# Altium schematic sheet LIDO-HW.100.Page_10.SchDoc
size A3; SheetNumber: 14; SheetTotal: 14
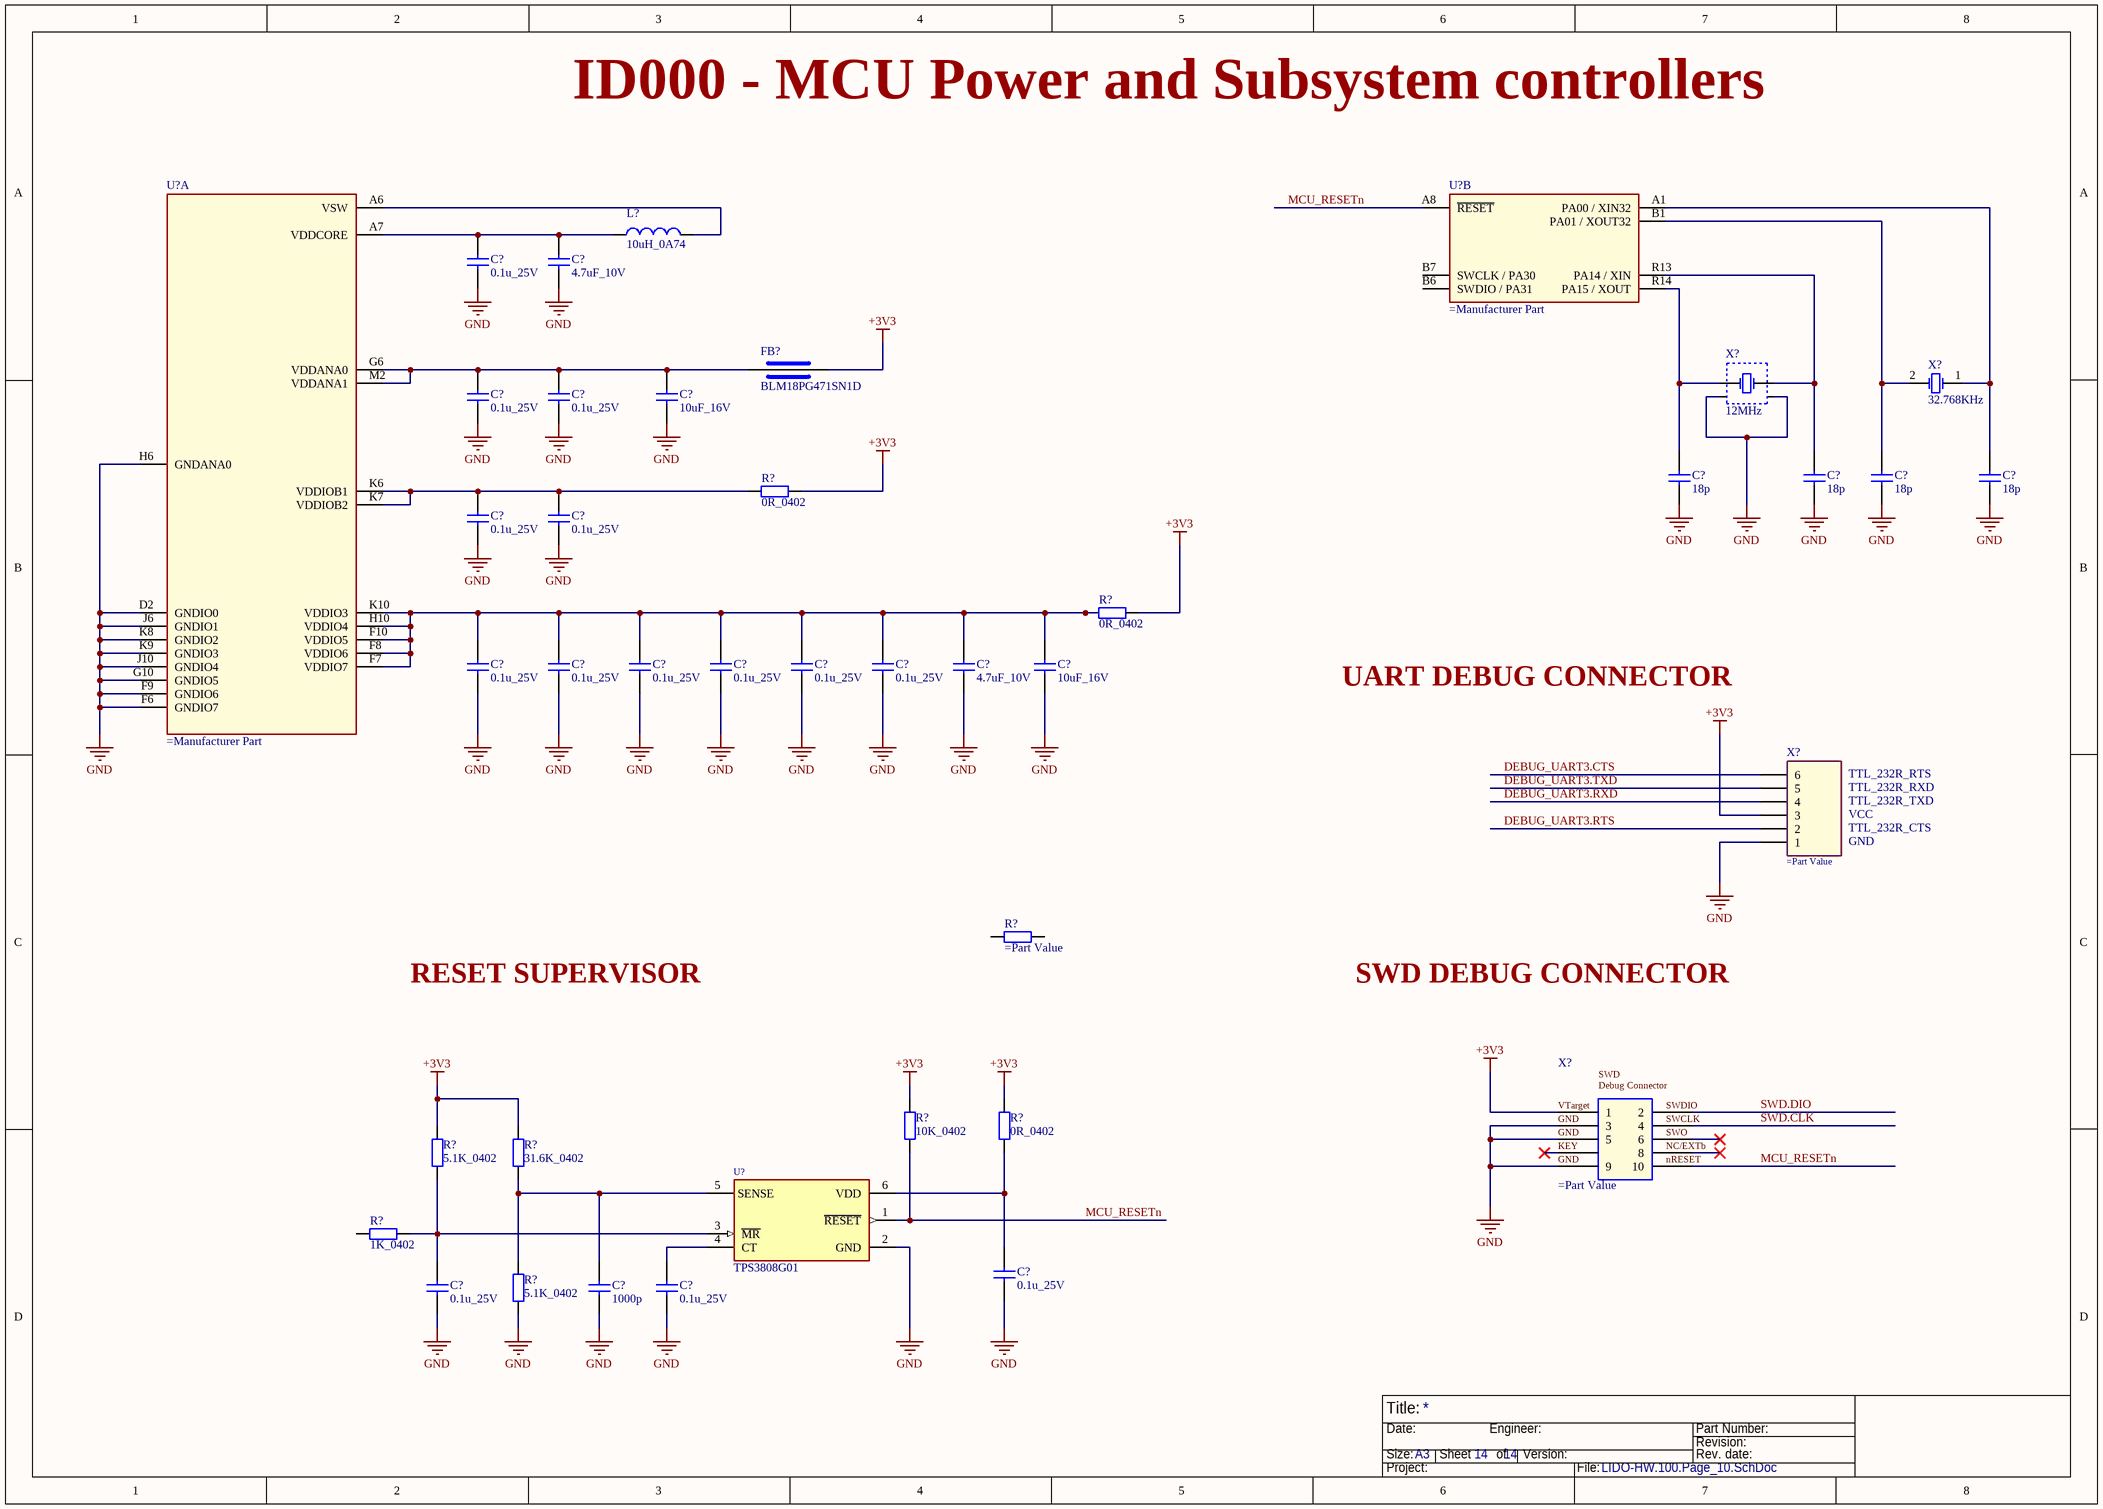
[diagram p0: LIDO-HW.100.Page_10.SchDoc]

## Parts
(Parts that share a designator on the sheet are numbered #1, #2 ... from top to bottom, then left to right.)
C?#1  0.1u_25V
C?#2  4.7uF_10V
C?#3  0.1u_25V
C?#4  0.1u_25V
C?#5  10uF_16V
C?#6  18p
C?#7  18p
C?#8  18p
C?#9  18p
C?#10  0.1u_25V
C?#11  0.1u_25V
C?#12  0.1u_25V
C?#13  0.1u_25V
C?#14  0.1u_25V
C?#15  0.1u_25V
C?#16  0.1u_25V
C?#17  0.1u_25V
C?#18  4.7uF_10V
C?#19  10uF_16V
C?#20  0.1u_25V
C?#21  0.1u_25V
C?#22  1000p
C?#23  0.1u_25V
FB?  BLM18PG471SN1D
L?  10uH_0A74
R?#1  0R_0402
R?#2  0R_0402
R?#3  (no value)
R?#4  10K_0402
R?#5  0R_0402
R?#6  5.1K_0402
R?#7  31.6K_0402
R?#8  1K_0402
R?#9  5.1K_0402
U?#1  (no value)  (part B of 4)
U?#2  (no value)  (part A of 4)
U?#3  TPS3808G01  [SOT95P280X145-6N]
X?#1  12MHz
X?#2  32.768KHz
X?#3  (no value)
X?#4  (no value)

## Nets
+3V3: FB?.2 R?#1.2 R?#2.2 R?#4.2 R?#5.2 R?#6.2 R?#7.2 X?#3.3 X?#4.1
GND: C?#1.2 C?#2.2 C?#3.2 C?#4.2 C?#5.2 C?#6.2 C?#7.2 C?#8.2 C?#9.2 C?#10.2 C?#11.2 C?#12.2 C?#13.2 C?#14.2 C?#15.2 C?#16.2 C?#17.2 C?#18.2 C?#19.2 C?#20.2 C?#21.2 C?#22.2 C?#23.2 R?#9.1 U?#2.D2(GNDIO0) U?#2.F6(GNDIO7) U?#2.F9(GNDIO6) U?#2.G10(GNDIO5) U?#2.H6(GNDANA0) U?#2.J6(GNDIO1) U?#2.J10(GNDIO4) U?#2.K8(GNDIO2) U?#2.K9(GNDIO3) U?#3.2(GND) X?#1.2(GND) X?#1.4(GND) X?#3.1 X?#4.3 X?#4.5 X?#4.9
DEBUG_UART3.CTS: X?#3.6
DEBUG_UART3.RTS: X?#3.2
DEBUG_UART3.RXD: X?#3.4
DEBUG_UART3.TXD: X?#3.5
MCU_RESETn: R?#4.1 U?#1.A8(~{RESET}) U?#3.1(~{RESET}) X?#4.10
SWD.CLK: X?#4.4
SWD.DIO: X?#4.2
NetC?#1_1: C?#1.1 C?#2.1 L?.1 U?#2.A7(VDDCORE)
NetC?#3_1: C?#3.1 C?#4.1 C?#5.1 FB?.1 U?#2.G6(VDDANA0) U?#2.M2(VDDANA1)
NetC?#6_1: C?#6.1 U?#1.R14(PA15_/_XOUT) X?#1.3(OSC2)
NetC?#7_1: C?#7.1 U?#1.R13(PA14_/_XIN) X?#1.1(OSC1)
NetC?#8_1: C?#8.1 U?#1.B1(PA01_/_XOUT32) X?#2.2(OSC2)
NetC?#9_1: C?#9.1 U?#1.A1(PA00_/_XIN32) X?#2.1(OSC1)
NetC?#10_1: C?#10.1 C?#11.1 R?#1.1 U?#2.K6(VDDIOB1) U?#2.K7(VDDIOB2)
NetC?#12_1: C?#12.1 C?#13.1 C?#14.1 C?#15.1 C?#16.1 C?#17.1 C?#18.1 C?#19.1 R?#2.1 U?#2.F7(VDDIO7) U?#2.F8(VDDIO6) U?#2.F10(VDDIO5) U?#2.H10(VDDIO4) U?#2.K10(VDDIO3)
NetC?#20_1: C?#20.1 R?#5.1 U?#3.6(VDD)
NetC?#21_1: C?#21.1 R?#6.1 R?#8.1 U?#3.3(~{MR})
NetC?#22_1: C?#22.1 R?#7.1 R?#9.2 U?#3.5(SENSE)
NetC?#23_1: C?#23.1 U?#3.4(CT)
NetL?_2: L?.2 U?#2.A6(VSW)

Not connected (* = marked no-connect by the designer): R?#3 1 2; R?#8 2; U?#1 B6(SWDIO_/_PA31) B7(SWCLK_/_PA30); X?#4 6* 7* 8*

## Notes on the sheet
- ID000 - MCU Power and Subsystem controllers
- UART DEBUG CONNECTOR
- TTL_232R_RTS
- GND
- TTL_232R_CTS
- TTL_232R_TXD
- TTL_232R_RXD
- VCC
- RESET SUPERVISOR
- SWD DEBUG CONNECTOR
- Title:
- Size:
- Date:
- A3
- Sheet       of
- Engineer:
- Version:
- Part Number:
- Revision:
- Rev. date:
- Project:
- File:
- (in symbol 10Pin SWD Interface) SWD; Debug Connector; VTarget; SWDIO; GND; SWCLK; SWO; KEY; NC/EXTb; nRESET

## Library data of the parts
C?#1-C?#23 = Ceramic: Ceramic CAP Symbol
FB? = Ferrite Bead: Ferrite Bead Symbol
L? = Inductor: Inductor Symbol
R?#1-R?#9 = Resistor: Resistor Symbol
U?#1 U?#2 = ATMEL_ATSAME54P20A-CT_A: 32-bit ARM® Cortex®-M4F MCUs with 1 Msps 12-bit ADC, / QSPI, USB, Ethernet, and PTC
U?#3 = TI_TPS3808_A: IC SUPERVISOR 1 CHANNEL SOT23-6; Manufacturer: Texas Instruments; Manufacturer Part Number: TPS3808G01DBVR; Designer: Matt Drazenovich; Ratings: RoHS; Reviewed: Dekimo_30-06-2020; Case/Package: SOT-23-6; ComponentType: IC; Design Date: 04-11-2019; Max Operating Temperature: 125°C; Min Operating Temperature: -40°C; Value: TPS3808G01
X?#1 = XTAL_4Pins_A: Crystal with Four Pins, / X - 1 & 3 / GND - 2 & 4
X?#2 = XTAL 2Pins: Crystal with two pins
X?#3 = RECT_6pin_A: Rectengular connector, 6 pins, Version A
X?#4 = 10Pin SWD Interface: 10Pin Serial Wire Debug Interface  header SMT